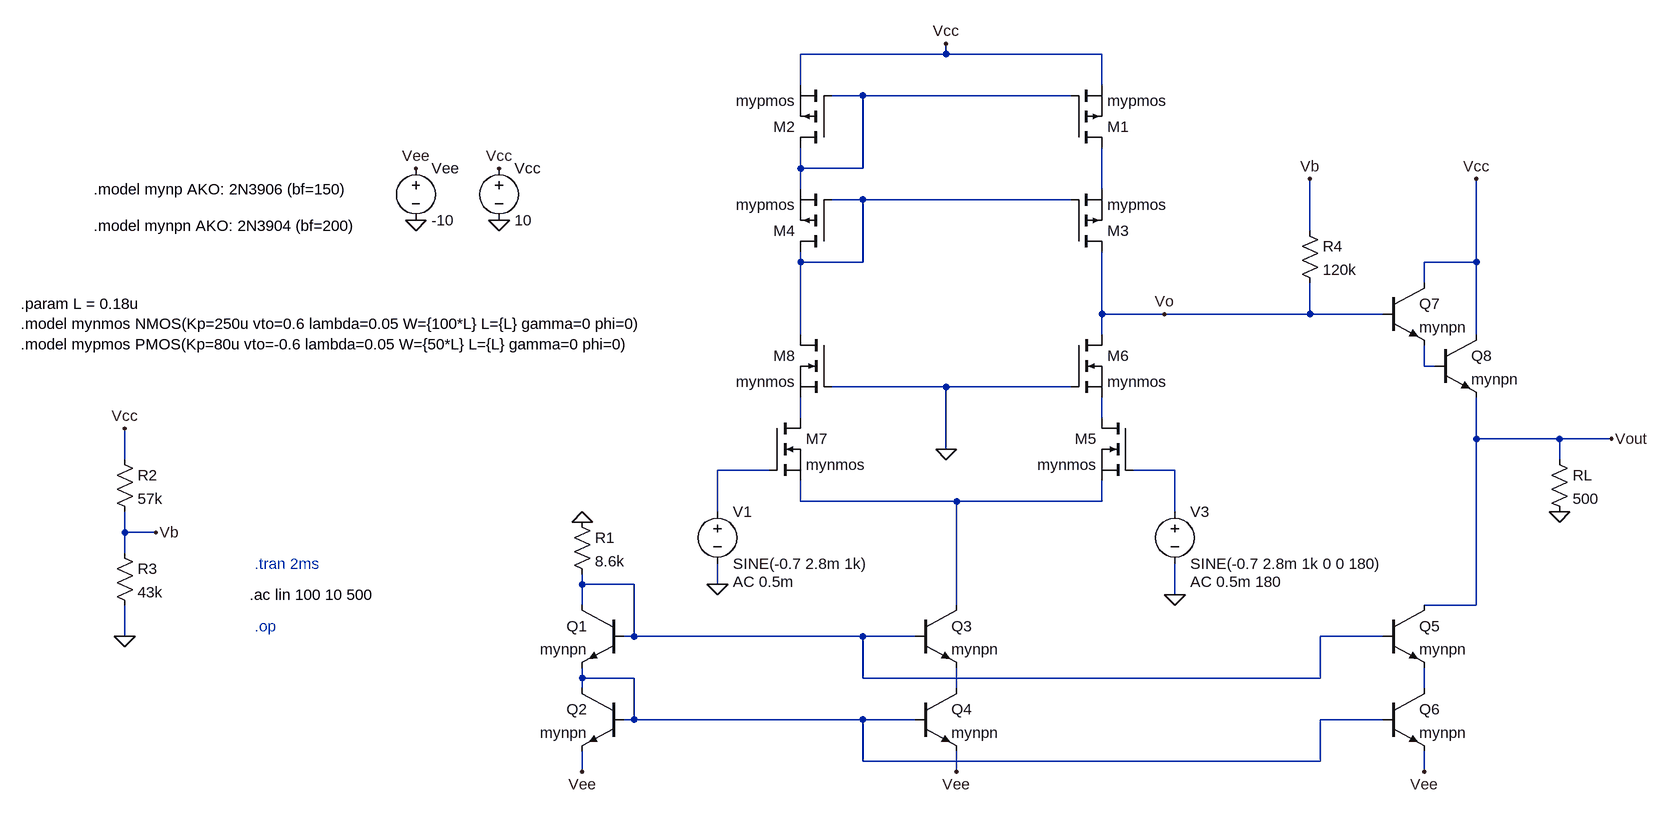
[diagram p0: schematic Ph1_403102322.asc]
Ph1_403102322.asc, the LTspice schematic file:
Version 4.1
SHEET 1 1764 680
WIRE 544 -640 544 -656
WIRE 544 -640 320 -640
WIRE 784 -640 544 -640
WIRE 320 -592 320 -640
WIRE 784 -592 784 -640
WIRE 416 -576 368 -576
WIRE 736 -576 416 -576
WIRE 320 -464 320 -496
WIRE 416 -464 416 -576
WIRE 416 -464 320 -464
WIRE 320 -432 320 -464
WIRE 784 -432 784 -496
WIRE 416 -416 368 -416
WIRE 736 -416 416 -416
WIRE 1104 -368 1104 -448
WIRE 320 -320 320 -336
WIRE 416 -320 416 -416
WIRE 416 -320 320 -320
WIRE 1360 -320 1360 -448
WIRE 1360 -320 1280 -320
WIRE 1280 -288 1280 -320
WIRE 784 -240 784 -336
WIRE 880 -240 784 -240
WIRE 1104 -240 1104 -288
WIRE 1104 -240 880 -240
WIRE 1216 -240 1104 -240
WIRE 320 -208 320 -320
WIRE 784 -208 784 -240
WIRE 1360 -208 1360 -320
WIRE 1280 -160 1280 -192
WIRE 1296 -160 1280 -160
WIRE 544 -128 368 -128
WIRE 736 -128 544 -128
WIRE 320 -80 320 -112
WIRE 784 -80 784 -112
WIRE 1360 -48 1360 -112
WIRE 1488 -48 1360 -48
WIRE 1568 -48 1488 -48
WIRE 544 -32 544 -128
WIRE -720 -16 -720 -64
WIRE 1488 -16 1488 -48
WIRE 272 0 192 0
WIRE 896 0 832 0
WIRE 320 48 320 16
WIRE 560 48 320 48
WIRE 784 48 784 16
WIRE 784 48 560 48
WIRE 192 64 192 0
WIRE 896 64 896 0
WIRE -720 96 -720 64
WIRE -672 96 -720 96
WIRE -720 128 -720 96
WIRE -16 176 -16 160
WIRE 64 176 -16 176
WIRE 192 176 192 144
WIRE 896 192 896 144
WIRE -16 208 -16 176
WIRE 560 208 560 48
WIRE 1360 208 1360 -48
WIRE 1360 208 1280 208
WIRE -720 256 -720 208
WIRE 64 256 64 176
WIRE 64 256 48 256
WIRE 416 256 64 256
WIRE 496 256 416 256
WIRE 1216 256 1120 256
WIRE -16 320 -16 304
WIRE 64 320 -16 320
WIRE 416 320 416 256
WIRE 1120 320 1120 256
WIRE 1120 320 416 320
WIRE -16 336 -16 320
WIRE 560 336 560 304
WIRE 1280 336 1280 304
WIRE 64 384 64 320
WIRE 64 384 48 384
WIRE 416 384 64 384
WIRE 496 384 416 384
WIRE 1216 384 1120 384
WIRE 416 448 416 384
WIRE 1120 448 1120 384
WIRE 1120 448 416 448
WIRE -16 464 -16 432
WIRE 560 464 560 432
WIRE 1280 464 1280 432
FLAG -16 80 0
FLAG -272 -384 0
FLAG -144 -384 0
FLAG -272 -464 Vee
FLAG -144 -464 Vcc
FLAG -16 464 Vee
FLAG 560 464 Vee
FLAG 192 176 0
FLAG 544 -656 Vcc
FLAG 896 192 0
FLAG 544 -32 0
FLAG 1280 464 Vee
FLAG 880 -240 Vo
FLAG 1360 -448 Vcc
FLAG 1568 -48 Vout
FLAG 1488 64 0
FLAG -720 256 0
FLAG -672 96 Vb
FLAG -720 -64 Vcc
FLAG 1104 -448 Vb
SYMBOL res -32 64 R0
SYMATTR InstName R1
SYMATTR Value 8.6k
SYMBOL npn 48 208 M0
SYMATTR InstName Q1
SYMATTR Value mynpn
SYMBOL npn 48 336 M0
SYMATTR InstName Q2
SYMATTR Value mynpn
SYMBOL npn 496 208 R0
SYMATTR InstName Q3
SYMATTR Value mynpn
SYMBOL npn 496 336 R0
SYMATTR InstName Q4
SYMATTR Value mynpn
SYMBOL voltage -272 -480 R0
SYMATTR InstName Vee
SYMATTR Value -10
SYMBOL voltage -144 -480 R0
SYMATTR InstName Vcc
SYMATTR Value 10
SYMBOL voltage 192 48 R0
WINDOW 123 24 124 Left 2
WINDOW 39 0 0 Left 0
SYMATTR Value2 AC 0.5m
SYMATTR InstName V1
SYMATTR Value SINE(-0.7 2.8m 1k)
SYMBOL voltage 896 48 R0
WINDOW 123 24 124 Left 2
WINDOW 39 0 0 Left 0
SYMATTR Value2 AC 0.5m 180
SYMATTR InstName V3
SYMATTR Value SINE(-0.7 2.8m 1k 0 0 180)
SYMBOL npn 1216 208 R0
SYMATTR InstName Q5
SYMATTR Value mynpn
SYMBOL npn 1216 336 R0
SYMATTR InstName Q6
SYMATTR Value mynpn
SYMBOL npn 1216 -288 R0
SYMATTR InstName Q7
SYMATTR Value mynpn
SYMBOL pmos 736 -496 M180
SYMATTR InstName M1
SYMATTR Value mypmos
SYMBOL pmos 368 -496 R180
SYMATTR InstName M2
SYMATTR Value mypmos
SYMBOL nmos 832 -80 M0
SYMATTR InstName M5
SYMATTR Value mynmos
SYMBOL nmos 272 -80 R0
SYMATTR InstName M7
SYMATTR Value mynmos
SYMBOL nmos 736 -208 R0
SYMATTR InstName M6
SYMATTR Value mynmos
SYMBOL nmos 368 -208 M0
SYMATTR InstName M8
SYMATTR Value mynmos
SYMBOL pmos 736 -336 M180
SYMATTR InstName M3
SYMATTR Value mypmos
SYMBOL pmos 368 -336 R180
SYMATTR InstName M4
SYMATTR Value mypmos
SYMBOL res 1088 -384 R0
SYMATTR InstName R4
SYMATTR Value 120k
SYMBOL npn 1296 -208 R0
SYMATTR InstName Q8
SYMATTR Value mynpn
SYMBOL res 1472 -32 R0
SYMATTR InstName RL
SYMATTR Value 500
SYMBOL res -736 -32 R0
SYMATTR InstName R2
SYMATTR Value 57k
SYMBOL res -736 112 R0
SYMATTR InstName R3
SYMATTR Value 43k
TEXT -768 -432 Left 2 !.model mynp AKO: 2N3906 (bf=150)
TEXT -768 -376 Left 2 !.model mynpn AKO: 2N3904 (bf=200)
TEXT -880 -256 Left 2 !.param L = 0.18u\n.model mynmos NMOS(Kp=250u vto=0.6 lambda=0.05 W={100*L} L={L} gamma=0 phi=0)\n.model mypmos PMOS(Kp=80u vto=-0.6 lambda=0.05 W={50*L} L={L} gamma=0 phi=0)
TEXT -520 240 Left 2 ;.op
TEXT -528 192 Left 2 !.ac lin 100 10 500
TEXT -520 144 Left 2 ;.tran 2ms

The netlist it stands for:
* Ph1_403102322.asc
R1 0 N010 8.6k
Q1 N010 N010 N011 0 mynpn
Q2 N011 N011 Vee 0 mynpn
Q3 N009 N010 N012 0 mynpn
Q4 N012 N011 Vee 0 mynpn
Vee Vee 0 -10
Vcc Vcc 0 10
V1 N007 0 SINE(-0.7 2.8m 1k) AC 0.5m
V3 N008 0 SINE(-0.7 2.8m 1k 0 0 180) AC 0.5m 180
Q5 Vout N010 N013 0 mynpn
Q6 N013 N011 Vee 0 mynpn
Q7 Vcc Vo N004 0 mynpn
M1 N002 N001 Vcc Vcc mypmos
M2 N001 N001 Vcc Vcc mypmos
M5 N006 N008 N009 N009 mynmos
M7 N005 N007 N009 N009 mynmos
M6 Vo 0 N006 N006 mynmos
M8 N003 0 N005 N005 mynmos
M3 Vo N003 N002 N002 mypmos
M4 N003 N003 N001 N001 mypmos
R4 Vb Vo 120k
Q8 Vcc N004 Vout 0 mynpn
RL Vout 0 500
R2 Vcc Vb 57k
R3 Vb 0 43k
.model NPN NPN
.model PNP PNP
.lib standard.bjt
.model NMOS NMOS
.model PMOS PMOS
.lib standard.mos
.model mynp AKO: 2N3906 (bf=150)
.model mynpn AKO: 2N3904 (bf=200)
.param L = 0.18u
.model mynmos NMOS(Kp=250u vto=0.6 lambda=0.05 W={100*L} L={L} gamma=0 phi=0)
.model mypmos PMOS(Kp=80u vto=-0.6 lambda=0.05 W={50*L} L={L} gamma=0 phi=0)
* .op
.ac lin 100 10 500
* .tran 2ms
.backanno
.end